# Altium schematic sheet power.SchDoc: FastIC+ readout
size 420 x 297 mm; CheckedBy: Jerome A. Alozy; CompanyName: CERN; DrawnBy: Vojtech Vosahlo; Organization: CERN; Address1: European Organization for Nuclear Research; Address2: CH-1211 Genève 23 - Switzerland; Revision: 2.0; SheetNumber: 6; SheetTotal: 6; Projet: Fast Timing; CreateDate: 11/1/2024; DivGrp: EP-ESE; Designer: Vojtech Vosahlo; ModifiedDate: -
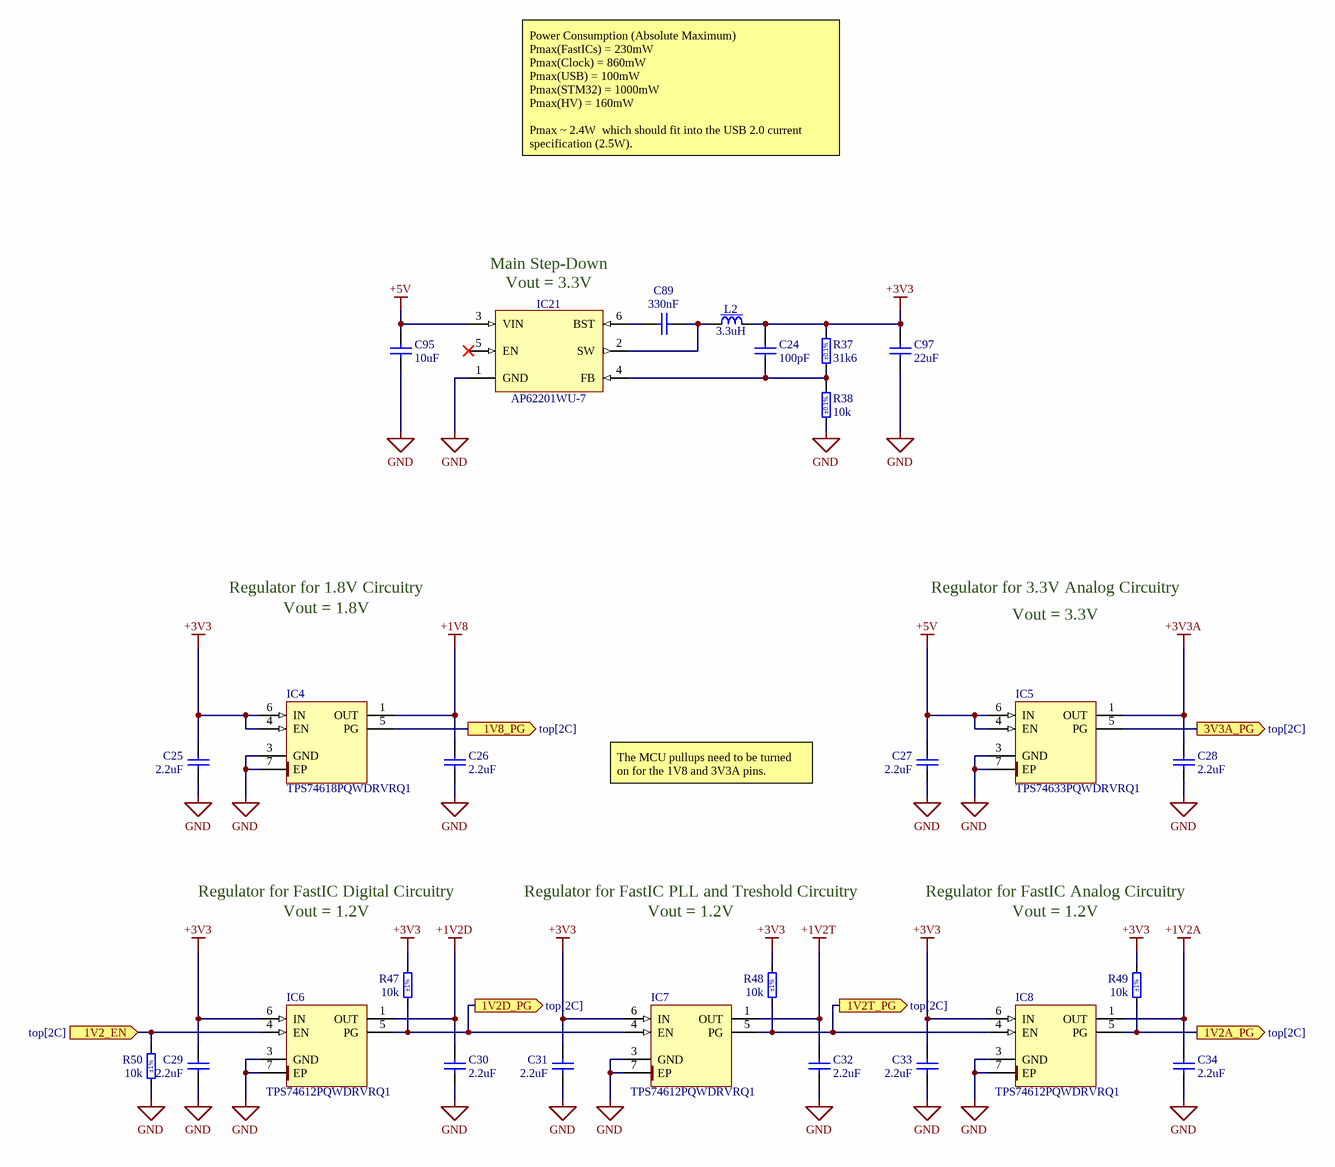
[diagram p0: power.SchDoc]

## Parts
C24  100pF  [CAPC1005X55N]
C25  2.2uF  [CAPC1608X90N]
C26  2.2uF  [CAPC1608X90N]
C27  2.2uF  [CAPC1608X90N]
C28  2.2uF  [CAPC1608X90N]
C29  2.2uF  [CAPC1608X90N]
C30  2.2uF  [CAPC1608X90N]
C31  2.2uF  [CAPC1608X90N]
C32  2.2uF  [CAPC1608X90N]
C33  2.2uF  [CAPC1608X90N]
C34  2.2uF  [CAPC1608X90N]
C89  330nF  [CAPC1005X55N]
C95  10uF  [CAPC2012X145N]
C97  22uF  [CAPC2013X145N]
IC4  TPS74618PQWDRVRQ1  [SON65P200X200X80-7N-R110X170]
IC5  TPS74633PQWDRVRQ1  [SON65P200X200X80-7N-R110X170]
IC6  TPS74612PQWDRVRQ1  [SON65P200X200X80-7N-R110X170]
IC7  TPS74612PQWDRVRQ1  [SON65P200X200X80-7N-R110X170]
IC8  TPS74612PQWDRVRQ1  [SON65P200X200X80-7N-R110X170]
IC21  AP62201WU-7  [SOT95P2d80X100-6N]
L2  3.3uH  [IND_COILCRAFT_XAL4030]
R37  31k6  Tolerance: ±0.1%  [RESC1005X35N]
R38  10k  Tolerance: ±0.1%  [RESC1005X35N]
R47  10k  Tolerance: ±1%  [RESC1005X40N]
R48  10k  Tolerance: ±1%  [RESC1005X40N]
R49  10k  Tolerance: ±1%  [RESC1005X40N]
R50  10k  Tolerance: ±1%  [RESC1005X40N]

## Ports
1V2_EN (in, see top[2C]), 1V2A_PG (out, see top[2C]), 1V2D_PG (out, see top[2C]), 1V2T_PG (out, see top[2C]), 1V8_PG (out, see top[2C]), 3V3A_PG (out, see top[2C])

## Nets
+1V2A: C34.2 IC8.1(OUT)
+1V2D: C30.2 IC6.1(OUT)
+1V2T: C32.2 IC7.1(OUT)
+1V8: C26.2 IC4.1(OUT)
+3V3: C24.2 C25.2 C29.2 C31.2 C33.2 C97.2 IC4.4(EN) IC4.6(IN) IC6.6(IN) IC7.6(IN) IC8.6(IN) L2.2 R37.2 R47.2 R48.2 R49.2
+3V3A: C28.2 IC5.1(OUT)
+5V: C27.2 C95.2 IC5.4(EN) IC5.6(IN) IC21.3(VIN)
GND: C25.1 C26.1 C27.1 C28.1 C29.1 C30.1 C31.1 C32.1 C33.1 C34.1 C95.1 C97.1 IC4.3(GND) IC4.7(EP) IC5.3(GND) IC5.7(EP) IC6.3(GND) IC6.7(EP) IC7.3(GND) IC7.7(EP) IC8.3(GND) IC8.7(EP) IC21.1(GND) R38.1 R50.1
1V2_EN: IC6.4(EN) R50.2 ; port 1V2_EN
1V2A_PG: IC8.5(PG) R49.1 ; port 1V2A_PG
1V2D_PG: IC6.5(PG) IC7.4(EN) R47.1 ; port 1V2D_PG
1V2T_PG: IC7.5(PG) IC8.4(EN) R48.1 ; port 1V2T_PG
1V8_PG: IC4.5(PG) ; port 1V8_PG
3V3A_PG: IC5.5(PG) ; port 3V3A_PG
NetC24_1: C24.1 IC21.4(FB) R37.1 R38.2
NetC89_1: C89.1 IC21.6(BST)
NetC89_2: C89.2 IC21.2(SW) L2.1

Not connected (* = marked no-connect by the designer): IC21 5(EN)*

## Notes on the sheet
- Power Consumption (Absolute Maximum)
  Pmax(FastICs) = 230mW
  Pmax(Clock) = 860mW
  Pmax(USB) = 100mW
  Pmax(STM32) = 1000mW
  Pmax(HV) = 160mW
  Pmax ~ 2.4W  which should fit into the USB 2.0 current specification (2.5W).
- Main Step-Down
- (near IC21) Vout = 3.3V
- Regulator for 1.8V Circuitry
- Regulator for 3.3V Analog Circuitry
- Vout = 1.8V
- Vout = 3.3V
- The MCU pullups need to be turned on for the 1V8 and 3V3A pins.
- Regulator for FastIC Digital Circuitry
- Vout = 1.2V
- Regulator for FastIC PLL and Treshold Circuitry
- Regulator for FastIC Analog Circuitry
- Project/Equipment
- Document
- Designer
- Drawn by
- Check.by
- File
- Last Mod.
- Print Date
- Sheet
- Size
- A3
- of
- Rev

## Library data of the parts
C24 = CC0402_100PF_50V_5%_C0G: Non-polarised capacitor; Part Description: SMD Multilayer Chip Ceramic Capacitor; Manufacturer: GENERIC; Manufacturer1 Part Number: C0402C101J5GACTU; Voltage: 50V; TC: C0G/NP0; Tolerance: ±5%; Part Number: CC0402_100PF_50V_5%_C0G; Component Kind: Standard; Component Type: Standard; Pin Count: 2; Value: 100pF; Status: Preferred; Manufacturer Part Number: CC0402_100PF_50V_5%_C0G; Case: 0402; Mounted: Yes; Socket: No; SMD: Yes; Sense: No; Manufacturer1 Example: KEMET; Manufacturer1 ComponentHeight: 0.55mm; HelpURL: \\cern.ch\dfs\Applications\Altium\Datasheets\CC0402_C0G_KEMET_(Commercial Grade).pdf; Author: CERN DEM JLC; CreateDate: 12/3/2007; LatestRevisionDate: 4/22/2015
C25-C34 = CC0603_2.2UF_10V_20%_X7R: Non-polarised capacitor; Part Description: SMD Multilayer Chip Ceramic Capacitor; Manufacturer: GENERIC; Manufacturer1 Part Number: LMK107B7225MA-T; Voltage: 10V; TC: X7R; Tolerance: ±20%; Part Number: CC0603_2.2UF_10V_20%_X7R; Component Kind: Standard; Component Type: Standard; Pin Count: 2; Value: 2.2uF; Status: Not Recommended; Manufacturer Part Number: CC0603_2.2UF_10V_20%_X7R; Case: 0603; Mounted: Yes; Socket: No; SMD: Yes; Sense: No; Manufacturer1 Example: TAIYO YUDEN; Manufacturer1 ComponentHeight: 0.9mm; HelpURL: \\cern.ch\dfs\Applications\Altium\Datasheets\CC0603_X7R_TAIYO-YUDEN_HIGH-VALUE.pdf; Author: CERN DEM JLC; CreateDate: 6/22/2011; LatestRevisionDate: 6/27/2011
C89 = CC0402_330NF_35V_20%_X5R: Non-polarised capacitor; Part Description: SMD Multilayer Chip Ceramic Capacitor; Manufacturer: GENERIC; Manufacturer1 Part Number: C1005X5R1V334M050; Voltage: 35V; TC: X5R; Tolerance: ±20%; Part Number: CC0402_330NF_35V_20%_X5R; Component Kind: Standard; Component Type: Standard; Pin Count: 2; Value: 330nF; Status: Preferred; Manufacturer Part Number: CC0402_330NF_35V_20%_X5R; Case: 0402; Mounted: Yes; Socket: No; SMD: Yes; Sense: No; Manufacturer1 Example: TDK; Manufacturer1 ComponentHeight: 0.55mm; HelpURL: \\cern.ch\dfs\Applications\Altium\Datasheets\CC0402_X5R_TDK_C.pdf; Author: CERN DEM MR; CreateDate: 9/13/2016; LatestRevisionDate: 9/13/2016
C95 = CC0805_10UF_35V_10%_X5R_MURATA_GRM21BR6YA106KE43L: Non-polarised capacitor; Part Description: Chip Multilayer Ceramic Capacitor for General Purpose; Manufacturer: MURATA; Voltage: 35V; TC: X5R; Tolerance: ±10%; Part Number: CC0805_10UF_35V_10%_X5R_MURATA_GRM21BR6YA106KE43L; Component Kind: Standard; Component Type: Standard; Pin Count: 2; Value: 10uF; Status: Not Recommended; Manufacturer Part Number: GRM21BR6YA106KE43; Case: 0805; Mounted: Yes; Socket: No; SMD: Yes; Sense: No; ComponentHeight: 1.45mm; HelpURL: \\cern.ch\dfs\Applications\Altium\Datasheets\CC0805_MURATA_GRM21BR6YA106KE43L.pdf; Author: CERN DEM BC; CreateDate: 3/24/2020; LatestRevisionDate: 3/24/2020
C97 = CC0805_22UF_25V_20%_X5R_MURATA_GRM21BR61E226ME44: Non-polarised capacitor; Part Description: Chip Multilayer Ceramic Capacitor for General Purpose; Manufacturer: MURATA; Voltage: 25V; TC: X5R; Tolerance: ±20%; Part Number: CC0805_22UF_25V_20%_X5R_MURATA_GRM21BR61E226ME44; Component Kind: Standard; Component Type: Standard; Pin Count: 2; Value: 22uF; Status: Not Recommended; Manufacturer Part Number: GRM21BR61E226ME44; Case: 0805; Mounted: Yes; Socket: No; SMD: Yes; Sense: No; ComponentHeight: 1.45mm; HelpURL: \\cern.ch\dfs\Applications\Altium\Datasheets\CC0805_MURATA_GRM21BR61E226ME44.pdf; Author: CERN DEM BC; CreateDate: 10/6/2020; LatestRevisionDate: 10/6/2020
IC21 = AP62201WU-7: 4.2V TO 18V INPUT, 2A LOW IQ SYNCHRONOUS BUCK CONVERTER; Manufacturer: DIODES INCORPORATED; PressFit: No; Bonding: No; Part Number: AP62201WU-7; Component Kind: Standard; Component Type: Standard; Device: AP62201WU-7; Footprint: SOT95P280X100-6N; PackageDescription: SOT23, 0.95mm Pitch; 6 Pin, 1.625mm W X 2.90mm L X 1.00mm H body, IPC Medium Density; Part Description: 4.2V To 18V Input, 2A Low Iq Synchronous Buck Converter; Manufacturer Part Number: AP62201WU; Pin Count: 6; Case: SOT23-6; Mounted: Yes; Socket: No; SMD: Yes; Sense: No; ComponentHeight: 1.1mm; HelpURL: \\cern.ch\dfs\Applications\Altium\Datasheets\AP6220x.pdf; Author: CERN DEM HF; CreateDate: 1/7/2022; LatestRevisionDate: 3/21/2022
L2 = IND_3.3UH_20%_COILCRAFT_XAL4030: Inductor With Core; Part Description: SMD Shielded Power Inductor; Manufacturer Part Number: XAL4030-332ME; Power: 5A; Resistance: 0.026R; Tolerance: ±20%; Part Number: IND_3.3UH_20%_COILCRAFT_XAL4030; Component Kind: Standard; Component Type: Standard; Pin Count: 2; Value: 3.3uH; Manufacturer: COILCRAFT; Mounted: Yes; Socket: No; SMD: Yes; Sense: No; ComponentHeight: 3.1mm; HelpURL: \\cern.ch\dfs\Applications\Altium\Datasheets\IND_COILCRAFT_XAL4030.pdf; Author: CERN DEM BC; CreateDate: 8/7/2019; LatestRevisionDate: 8/7/2019
R37 = R0402_31K6_0.1%_0.063W_25PPM_YAGEO_RT: Resistor - 0.1%; Part Description: Thin Film Chip Resistor; Manufacturer: YAGEO; Manufacturer Part Number: RT0402BRD0731K6L; Power: 0.063W; TC: ±25ppm/°C; Voltage: 50V; PressFit: No; Part Number: R0402_31K6_0.1%_0.063W_25PPM_YAGEO_RT; Component Kind: Standard; Component Type: Standard; Pin Count: 2; Value: 31k6; Status: Not Recommended; Case: 0402; Mounted: Yes; Sense: No; Socket: No; SMD: Yes; ComponentHeight: 0.35mm; HelpURL: \\cern.ch\dfs\Applications\Altium\Datasheets\R0402_YAGEO_RT.pdf; Author: CERN DEM BC; CreateDate: 7/30/2020; LatestRevisionDate: 7/30/2020
R38 = R0402_10K_0.1%_0.063W_25PPM: Resistor - 0.1%; Part Description: Thin Film Precision Resistor; Manufacturer: GENERIC; Manufacturer1 Part Number: CPF0402B10KE1; Power: 0.063W; TC: ±25ppm/°C; PressFit: No; Part Number: R0402_10K_0.1%_0.063W_25PPM; Component Kind: Standard; Component Type: Standard; Pin Count: 2; Value: 10k; Status: Not Recommended; Manufacturer Part Number: R0402_10K_0.1%_0.063W_25PPM; Case: 0402; Mounted: Yes; Sense: No; Socket: No; SMD: Yes; Manufacturer1 Example: TE CONNECTIVITY; Manufacturer1 ComponentHeight: 0.35mm; HelpURL: \\cern.ch\dfs\Applications\Altium\Datasheets\R0402_TYCO_CPF.pdf; Author: CERN DEM JMW; CreateDate: 9/22/2015; LatestRevisionDate: 9/22/2015
R47-R50 = R0402_10K_1%_0.0625W_100PPM: Resistor - 1%; Part Description: General Purpose Thick Film Chip Resistor; Manufacturer: GENERIC; Manufacturer1 Part Number: 232270671003L; TC: ±100ppm/°C; PressFit: No; Part Number: R0402_10K_1%_0.0625W_100PPM; Component Kind: Standard; Component Type: Standard; Pin Count: 2; Value: 10k; Status: Not Recommended; Power: 0.0625W; Manufacturer Part Number: R0402_10K_1%_0.0625W_100PPM; Case: 0402; Mounted: Yes; Sense: No; Socket: No; SMD: Yes; Manufacturer1 Example: YAGEO PHYCOMP; Manufacturer1 ComponentHeight: 0.4mm; HelpURL: \\cern.ch\dfs\Applications\Altium\Datasheets\R0402_Phycomp_RC0402.pdf; Author: CERN DEM JLC; CreateDate: 12/3/2007; LatestRevisionDate: 10/17/2012